# EAGLE design tinyTHP (EAGLE 6.5.0)
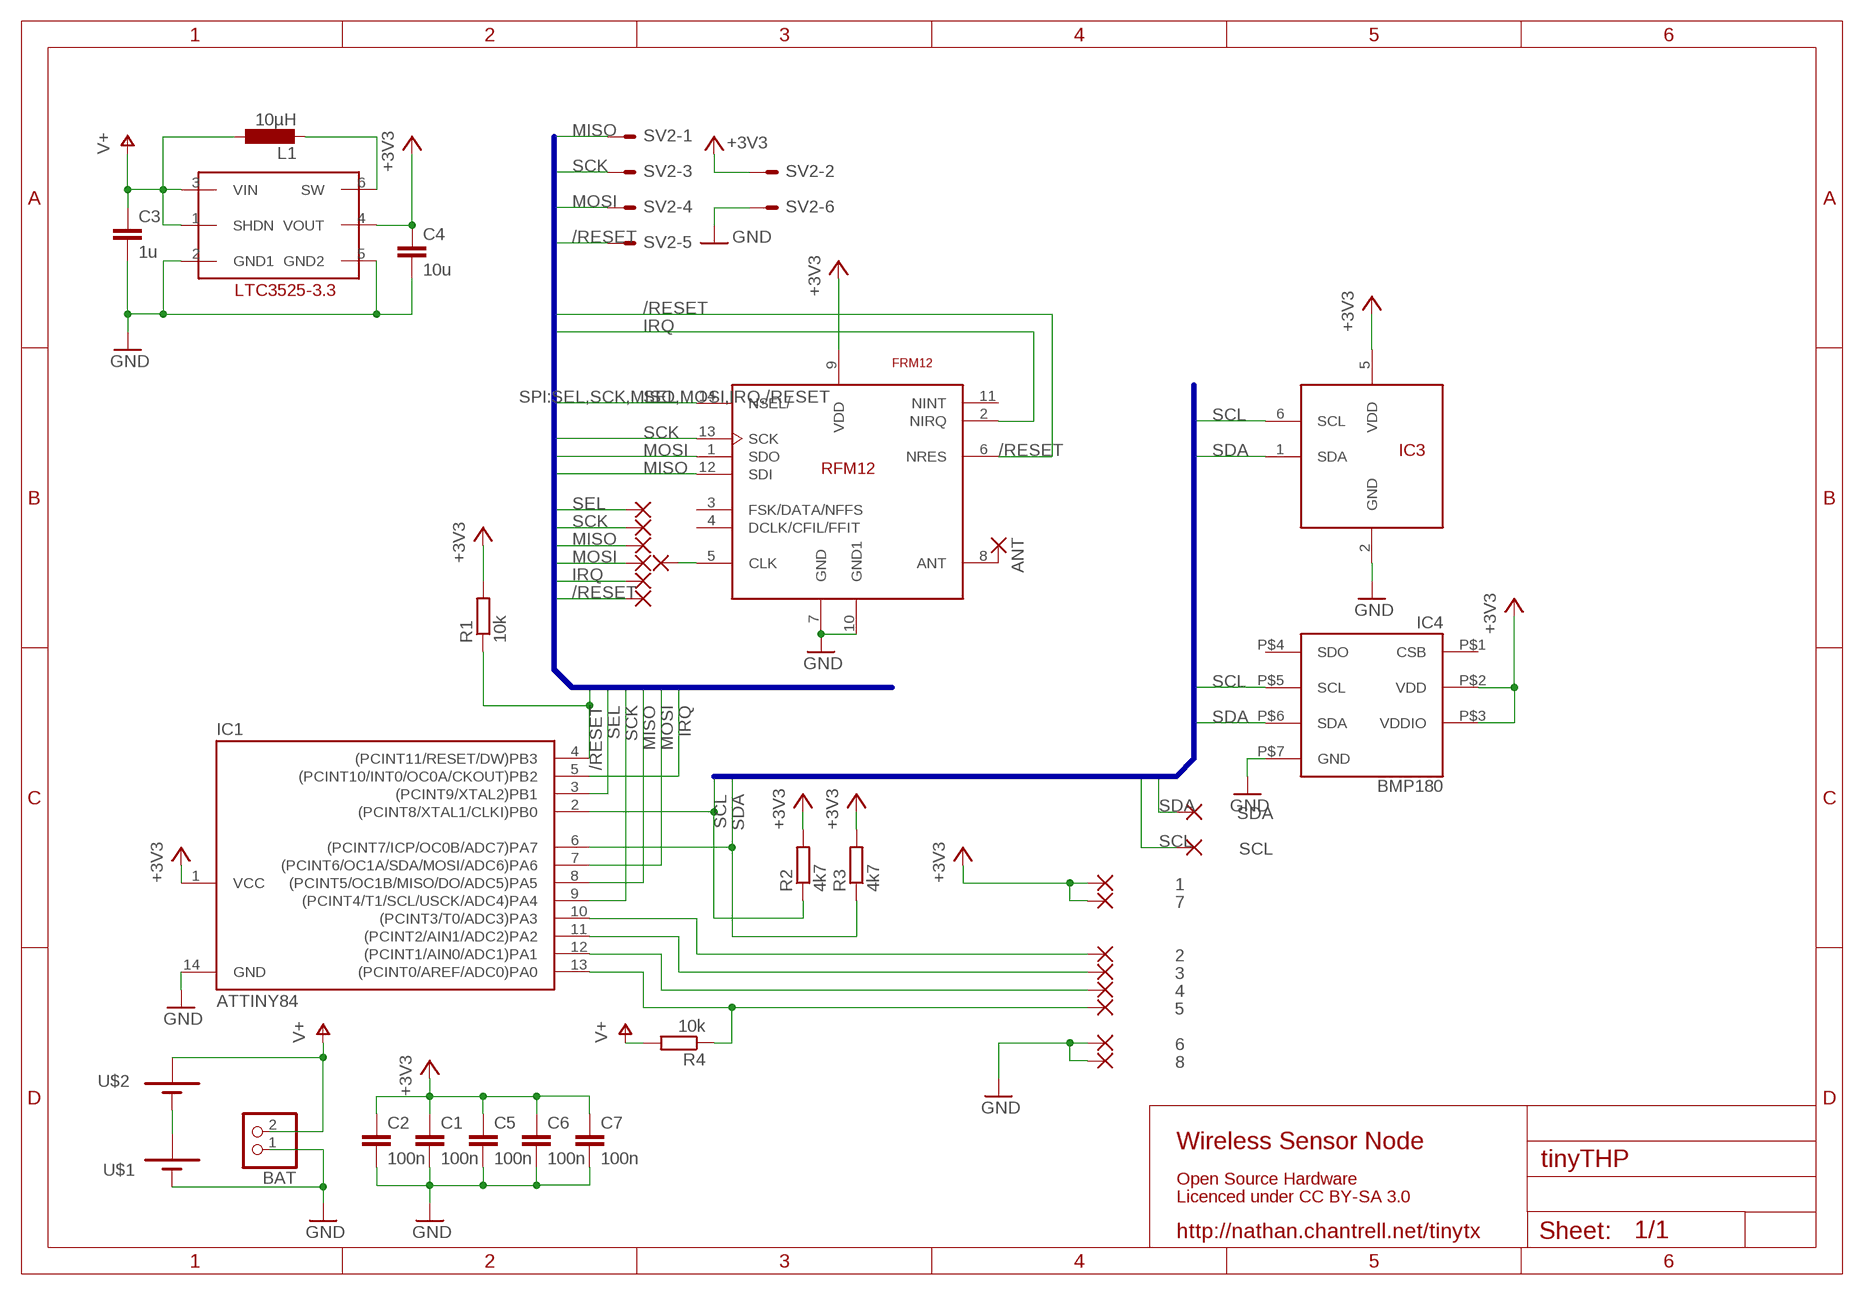
[diagram p0: schematic, sheet 1]

## Parts
1  1,6/0,9  [1,6/0,9]
2  1,6/0,9  [1,6/0,9]
3  1,6/0,9  [1,6/0,9]
4  1,6/0,9  [1,6/0,9]
5  1,6/0,9  [1,6/0,9]
6  1,6/0,9  [1,6/0,9]
7  1,6/0,9  [1,6/0,9]
8  1,6/0,9  [1,6/0,9]
/IRQ  1,6/0,9  [1,6/0,9]
/RESET  1,6/0,9  [1,6/0,9]
ANT  1,6/0,8  [1,6/0,8]
BAT  PINHD-1X2  [1X02]
C1  100n  C-EUC0603  [C0603]
C2  100n  C-EUC0603  [C0603]
C3  1u  C-EUC0603  [C0603]
C4  10u  C-EUC0603  [C0603]
C5  100n  C-EUC0603  [C0603]
C6  100n  C-EUC0603  [C0603]
C7  100n  C-EUC0603  [C0603]
IC1  ATTINY84  TINY24/44/84-SSU  [SOIC14]
IC2  IC2  LTC3525  [SC70-6]
IC3  SI7021  [DFN-6]
IC4  BMP180  [LGA-7]
L1  10µH  L-EUL1616  [L1616]
MISO  1,6/0,9  [1,6/0,9]
MOSI  1,6/0,9  [1,6/0,9]
R1  10k  R-EU_R0603  [R0603]
R2  4k7  R-EU_R0603  [R0603]
R3  4k7  R-EU_R0603  [R0603]
R4  10k  R-EU_R0603  [R0603]
RFMCLK  1,6/0,9  [1,6/0,9]
SCK  1,6/0,9  [1,6/0,9]
SCL  1,6/0,9  [1,6/0,9]
SDA  1,6/0,9  [1,6/0,9]
SEL  1,6/0,9  [1,6/0,9]
SV2  ML6E  [ML6]
U$1  KEYSTONE-92-AA-BATTERY-HOLDER  [KEYSTONE-92-AA-BATTERY]
U$2  KEYSTONE-92-AA-BATTERY-HOLDER  [KEYSTONE-92-AA-BATTERY]
U$3  FRM12  [RFM12]

## Nets
+3V3: 1.1(P) 7.1(P) C1.1 C2.1 C4.1 C5.1 C6.1 C7.1 IC1.1(VCC) IC2.4(VOUT) IC3.5(VDD) IC4.P$2(VDD) IC4.P$3(VDDIO) R1.2 R2.2 R3.2 SV2.2 U$3.9(VDD)
/RESET: /RESET.1(P) IC1.4((PCINT11/RESET/DW)PB3) R1.1 SV2.5 U$3.6(NRES)
ANT: ANT.1(P) U$3.8(ANT)
GND: 6.1(P) 8.1(P) BAT.1 C1.2 C2.2 C3.2 C4.2 C5.2 C6.2 C7.2 IC1.14(GND) IC2.2(GND1) IC2.5(GND2) IC3.2(GND) IC4.P$7(GND) SV2.6 U$1.GND2(-) U$1.GND(-) U$3.7(GND) U$3.10(GND1)
IRQ: /IRQ.1(P) IC1.5((PCINT10/INT0/OC0A/CKOUT)PB2) U$3.2(NIRQ)
MISO: IC1.8((PCINT5/OC1B/MISO/DO/ADC5)PA5) MISO.1(P) SV2.1 U$3.12(SDI)
MOSI: IC1.7((PCINT6/OC1A/SDA/MOSI/ADC6)PA6) MOSI.1(P) SV2.4 U$3.1(SDO)
N$1: 2.1(P) IC1.10((PCINT3/T0/ADC3)PA3)
N$2: 3.1(P) IC1.11((PCINT2/AIN1/ADC2)PA2)
N$3: 4.1(P) IC1.12((PCINT1/AIN0/ADC1)PA1)
N$4: 5.1(P) IC1.13((PCINT0/AREF/ADC0)PA0) R4.1
N$5: U$1.VBATT1(+) U$1.VBATT(+) U$2.GND2(-) U$2.GND(-)
N$6: RFMCLK.1(P) U$3.5(CLK)
N$12: IC2.6(SW) L1.P$2
SCK: IC1.9((PCINT4/T1/SCL/USCK/ADC4)PA4) SCK.1(P) SV2.3 U$3.13(SCK)
SCL: IC1.2((PCINT8/XTAL1/CLKI)PB0) IC3.6(SCL) IC4.P$5(SCL) R2.1 SCL.1(P)
SDA: IC1.6((PCINT7/ICP/OC0B/ADC7)PA7) IC3.1(SDA) IC4.P$6(SDA) R3.1 SDA.1(P)
SEL: IC1.3((PCINT9/XTAL2)PB1) SEL.1(P) U$3.14(NSEL/)
V+: BAT.2 C3.1 IC2.1(SHDN) IC2.3(VIN) L1.P$1 R4.2 U$2.VBATT1(+) U$2.VBATT(+)
Unconnected: IC4.P$1(CSB) IC4.P$4(SDO) U$3.3(FSK/DATA/NFFS) U$3.4(DCLK/CFIL/FFIT) U$3.11(NINT)

## Buses
SPI:SEL,SCK,MISO,MOSI,IRQ,/RESET
I2C:SDA,SCL

## Notes on the sheet
- Wireless Sensor Node
- Open Source Hardware
- Licenced under CC BY-SA 3.0
- http://nathan.chantrell.net/tinytx

## Library data of the parts
1-8 /IRQ /RESET MISO MOSI RFMCLK SCK SCL SDA SEL = wirepad:1,6/0,9: THROUGH-HOLE PAD
ANT = wirepad:1,6/0,8: THROUGH-HOLE PAD
BAT = pinhead:PINHD-1X2: PIN HEADER
C1-C7 = rcl:C-EU: CAPACITOR, European symbol
IC1 = avr-5:TINY24/44/84
IC2 = ltc3525:LTC3525
IC3 = si7021:SI7021
IC4 = projecttree:BMP180
L1 = L1616FSR:L-EU: INDUCTOR, European symbol
R1-R4 = rcl:R-EU_: RESISTOR, European symbol
SV2 = con-harting-ml:ML6?E: HARTING; OC_FARNELL: unknown; OC_NEWARK: unknown
U$1 U$2 = Ava:KEYSTONE-92-AA-BATTERY-HOLDER
U$3 = RFM12:FRM12

## Net classes
0 default: clearance 0.205 mm

## Board
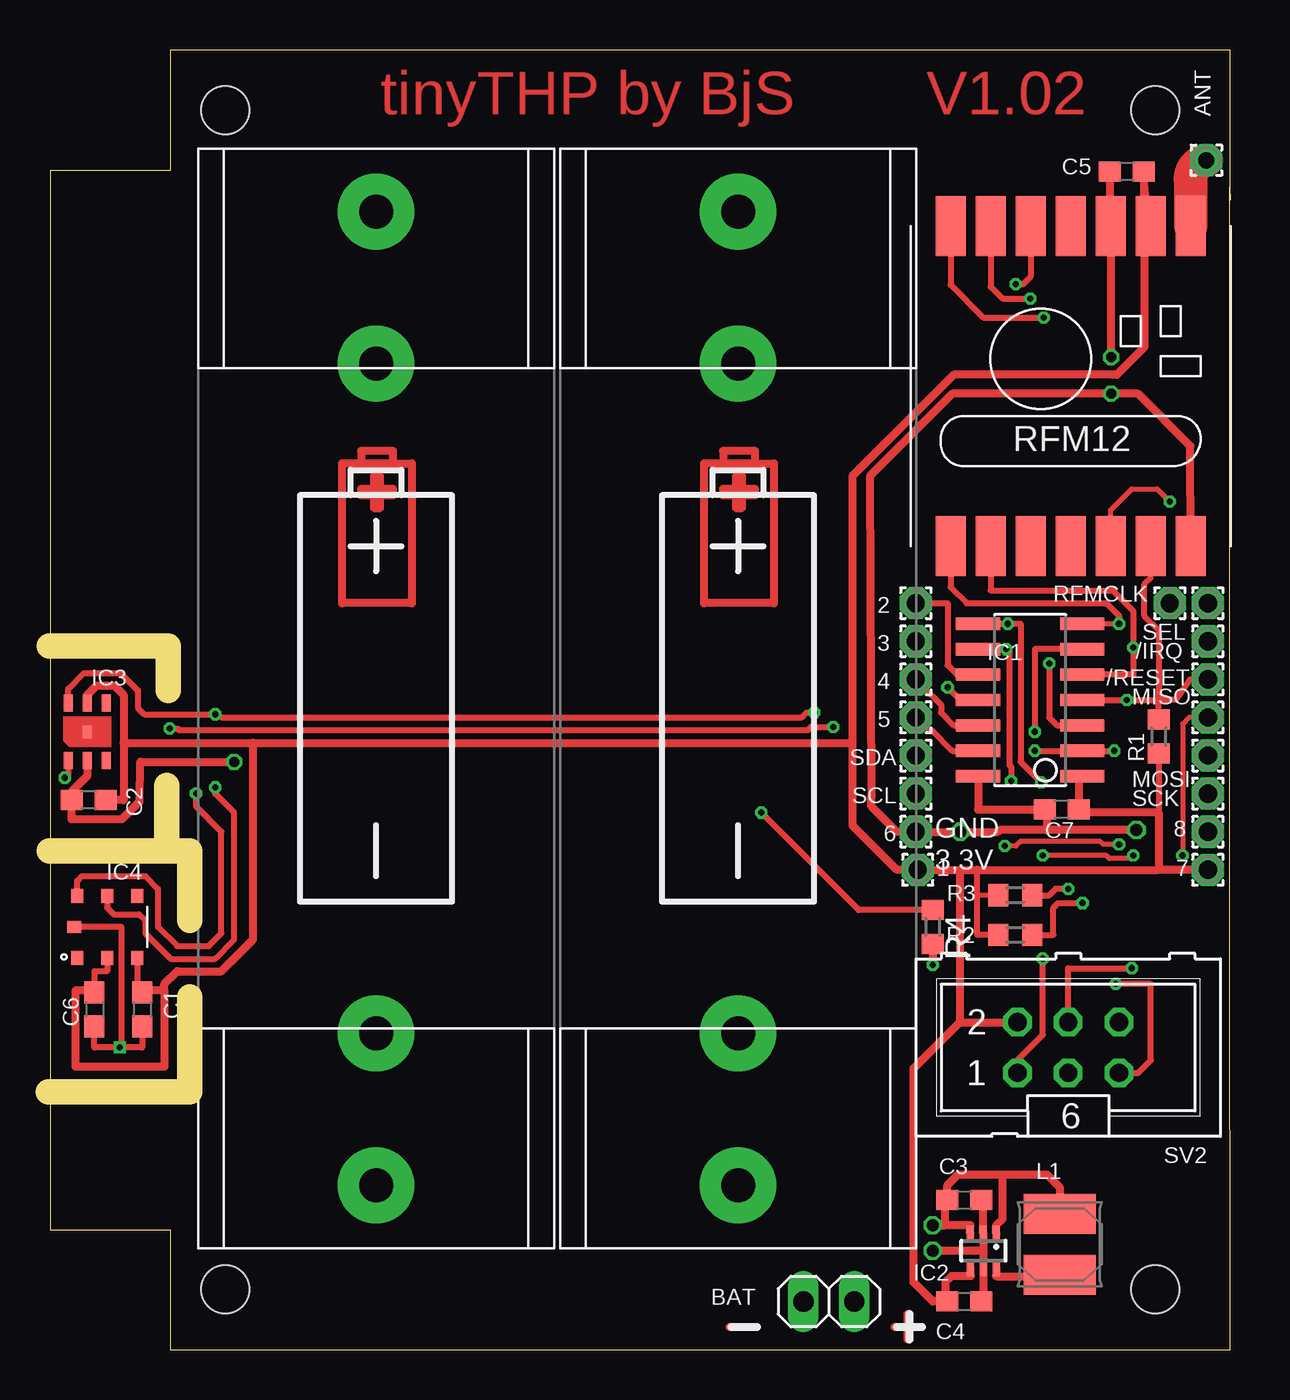
[diagram p1: board, top side]
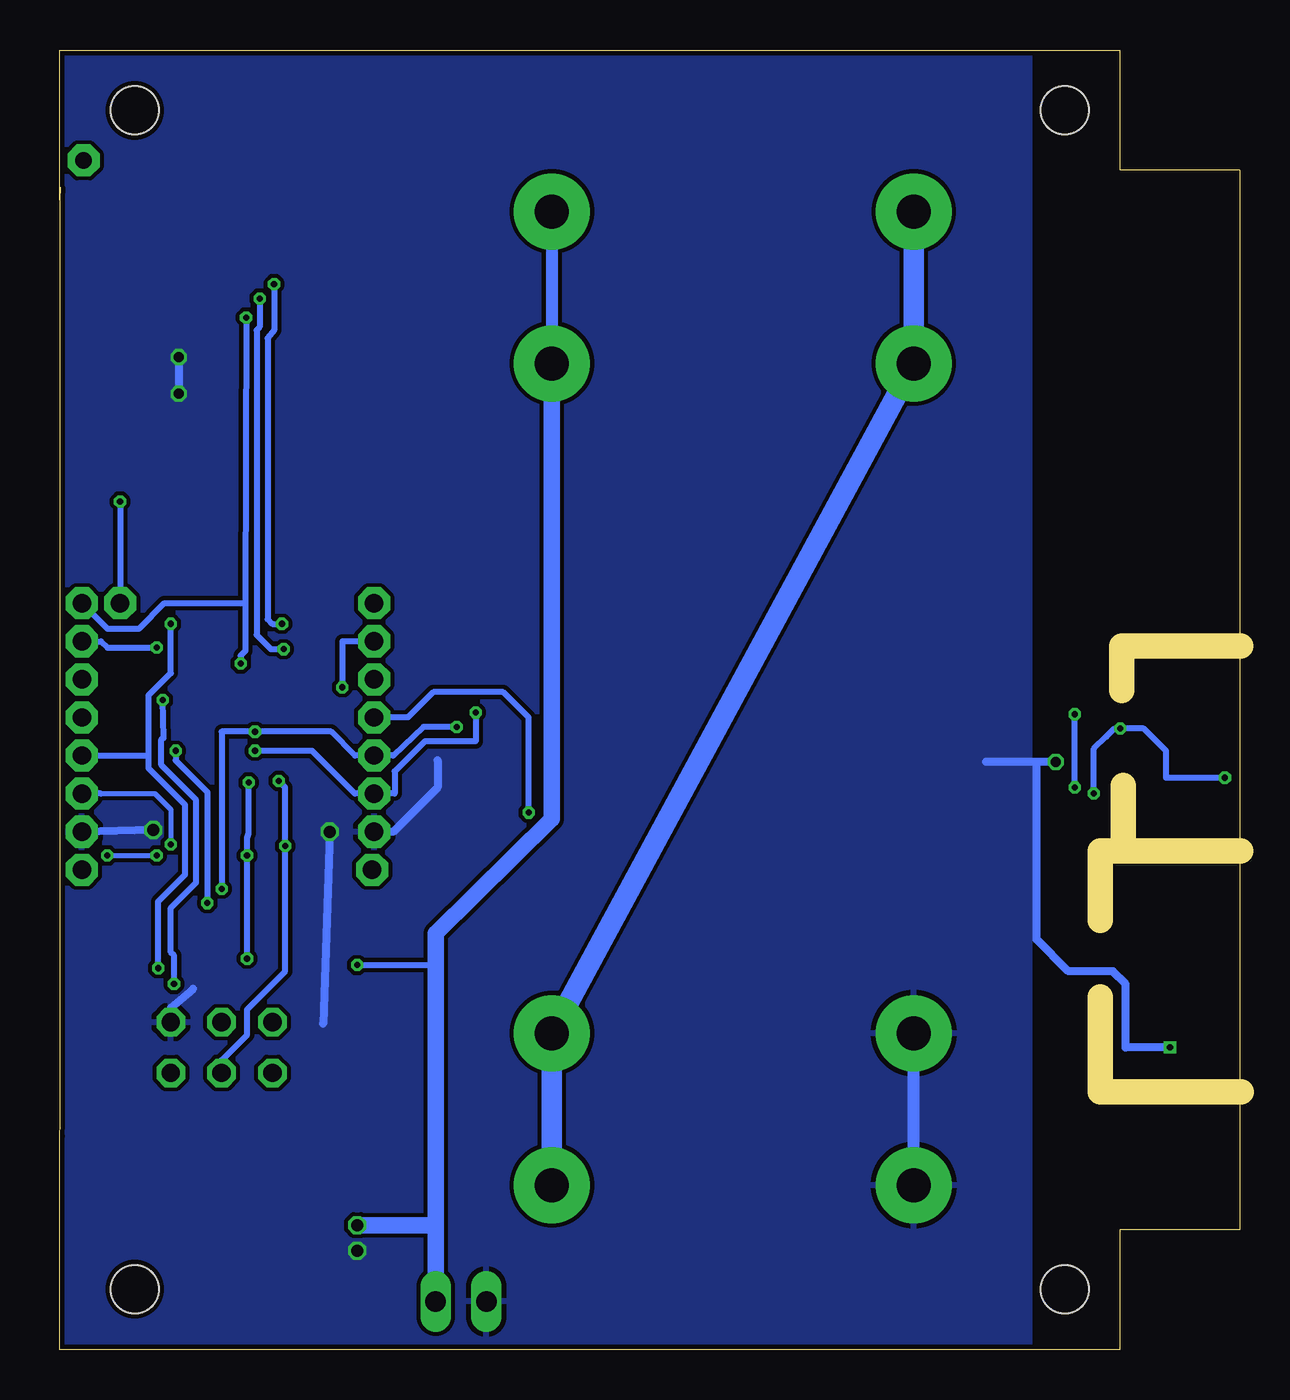
[diagram p2: board, bottom side, seen from below]

Size 59 x 65 mm. Coordinates in mm from the lower left corner, seen from the top.
Outline: 6,0 59,0 59,10.68 58.98,11.31 58.98,58.13 59,57.5 59,65 6,65 6,59 0,59 0,6 6,6 6,0
Copper layers (1*16): Top 0.035mm / dielectric 1.5mm / Bottom 0.035mm
Design rules "Elecrow_2-layer_eagle_rule": minimum track width 6mil, minimum drill 12mil, track to track 6mil, track to pad 6mil, pad to pad 6mil, via to via 6mil, smd to smd 0mil, copper to edge 10mil, drill to drill 10mil, minimum pad ring 10mil, minimum via ring 6mil, stop-mask expansion 2mil, vias tented up to drill 100mil, thermal gap 10mil
Holes 2.4 mm at 8.75,3.02 55.25,3.02 8.75,61.98 55.25,61.98
Milling: 8 lines

### Footprints (pad centres in the part's own frame; a part is rotated, then mirrored left to right if it is on the bottom)
1,6/0,9 = drill 0.914 pad 1.6 octagon: 1 0,0
1,6/0,8 = drill 0.813 pad 1.6 octagon: 1 0,0
1X02 = drill 1.016 long: 1 -1.27,0; 2 1.27,0
C0603 = smd 1.1 x 1: 1 -0.85,0; 2 0.85,0
SOIC14 = smd 0.61 x 2.21: 1 -3.81,-2.603; 2 -2.54,-2.603; 3 -1.27,-2.603; 4 0,-2.603; 5 1.27,-2.603; 6 2.54,-2.603; 7 3.81,-2.603; 8 3.81,2.603; 9 2.54,2.603; 10 1.27,2.603; 11 0,2.603; 12 -1.27,2.603; 13 -2.54,2.603; 14 -3.81,2.603
SC70-6 = smd 0.35 x 0.8: 1 -0.65,-0.85; 2 0,-0.85; 3 0.65,-0.85; 4 0.65,0.85; 5 0,0.85; 6 -0.65,0.85
DFN-6 = smd 0.45 x 0.83: 1 -0.95,-1.44; 2 0,-1.44; 3 0.95,-1.44; 4 0.95,1.435; 5 0,1.435; 6 -0.95,1.435 | smd 0.45 x 0.63: PAD 0,0
LGA-7 = smd 0.6 x 0.7: P$1 1.5,1.55; P$2 0,1.55; P$3 -1.5,1.55; P$4 -1.5,-1.55; P$5 0,-1.55; P$6 1.5,-1.55 | smd 0.7 x 0.6: P$7 1.65,0
L1616 = smd 2 x 3.6: P$1 -1.525,0; P$2 1.525,0
R0603 = smd 1 x 1.1: 1 -0.85,0; 2 0.85,0
ML6 = drill 0.914 octagon: 1 -2.54,-1.27; 2 -2.54,1.27; 3 0,-1.27; 4 0,1.27; 5 2.54,-1.27; 6 2.54,1.27
KEYSTONE-92-AA-BATTERY = drill 1.7 pad 3.81: GND -24.35,0; GND2 -16.75,0; VBATT 16.75,0; VBATT1 24.35,0
RFM12 = smd 1.5 x 3: 1 -5,-10; 2 -3,-10; 3 -1,-10; 4 1,-10; 5 3,-10; 6 5,-10; 7 7,-10; 8 7,6; 9 5,6; 10 3,6; 11 1,6; 12 -1,6; 13 -3,6; 14 -5,6

### Placement (x,y rotation side)
1  43.39,24 180 top
2  43.29,37.33 0 top
3  43.29,35.42 0 top
4  43.29,33.52 0 top
5  43.29,31.61 0 top
6  43.29,25.9 0 top
7  57.9,24 0 top
8  57.9,25.9 0 top
/IRQ  57.9,35.42 0 top
/RESET  57.9,33.52 0 top
ANT  57.82,59.48 0 top
BAT  38.94,2.41 0 top
C1  4.6,17.01 270 top
C2  1.94,27.49 180 top
C3  45.72,7.49 0 top
C4  45.72,2.41 0 top
C5  53.85,58.92 180 top
C6  2.22,17.01 270 top
C7  50.59,27.01 180 top
IC1  49.01,32.49 90 top
IC2  46.67,4.95 180 top
IC3  1.86,30.9 0 top
IC4  2.86,21.14 180 top
L1  50.48,5.26 270 top
MISO  57.9,31.61 0 top
MOSI  57.9,29.71 0 top
R1  55.43,30.66 270 top
R2  48.26,20.74 180 top
R3  48.26,22.73 180 top
R4  44.13,21.14 270 top
RFMCLK  55.99,37.33 0 top
SCK  57.9,27.8 0 top
SCL  43.29,27.8 0 top
SDA  43.29,29.71 0 top
SEL  57.9,37.33 0 top
SV2  50.91,15.11 0 top
U$1  16.3,32.57 90 top
U$2  34.4,32.57 90 top
U$3  50.04,50.19 0 top

### Tracks (layer width: path | path; a pad name or v marks a point on that pad's centre or on a via)
+3V3
  Top 0.254: R3.2 46.35,22.73
  Top 0.305: R1.2 55.43,26.85 | 46.35,24 46.35,22.73 46.35,20.74 R2.2 | 1.91,17.96 C6.1 2.22,17.96 2.22,18.91 2.86,18.91 IC4.P$2 | C1.1 4.36,17.86 IC4.P$3 4.36,17.96 4.45,17.96 C1.1 | 4.55,17.96 C1.1
  Top 0.406: IC3.5 1.86,32.73 2.33,33.2 3.21,33.2 3.68,32.73 3.68,30.34 | 3.68,30.34 3.68,27.49 C2.1 | 55.43,24 55.43,26.85 51.55,26.85 C7.1 51.44,28.68 IC1.1 | 40.12,30.34 40.12,43.68 45.2,48.76 53.13,48.76 53.34,48.76 54.72,50.14 54.72,58.09 U$3.9 54.7,56.53 C5.1 | 40.12,30.34 40.12,26.22 42.34,24 1.1 45.51,24 | 7.1 55.43,24 | 3.68,30.34 10.16,30.34 | 10.16,30.34 40.12,30.34 | 45.51,24 46.35,24 55.43,24 | 45.51,24 45.51,16.38 SV2.2 45.48,16.38 43.18,14.07 43.18,3.36 44.13,2.41 44.77,2.41 44.77,2.94 | 5.71,17.96 4.55,17.96 | 5.71,17.96 5.71,14.15 1.27,14.15 1.27,17.96 2.22,17.96 | 5.71,17.96 5.71,18.28 6.35,18.91 8.57,18.91 10.16,20.5 10.16,30.34 | 44.77,2.94 44.77,3.36 45.09,3.67 46.04,3.67 46.02,3.69 IC2.4 | 44.77,2.94 C4.1
/RESET  (via drill 0.3)
  Top 0.305: IC1.4 v53.85,32.49 55.43,32.49 | U$3.6 55.04,38.6 54.72,38.28 54.72,36.7 55.43,35.98 55.43,32.49 | 55.43,32.49 56.31,32.49 57.02,33.52 /RESET.1 | SV2.5 54.4,13.84 55.04,14.47 55.04,18.28 v53.29,18.28 | R1.1 55.43,32.49
  Bottom 0.305: v53.29,18.28 53.29,19.71 53.45,19.87 53.45,22.09 52.18,23.36 52.18,27.49 53.93,29.23 53.93,30.47 arc90 53.82,30.58 v53.85,32.49
ANT
  Top 1.676: U$3.8 57.04,58.38 arc-90 ANT.1
GND  (via drill 0.3, 0.5, 0.6)
  Top 0.305: IC4.P$7 3.57,21.14 3.57,15.18 | C1.2 4.6,15.11 3.57,15.11 | 3.57,15.11 v3.49,15.11 | v3.49,15.11 2.22,15.11 C6.2 | 3.57,15.18 3.57,15.11 | 3.57,15.18 v3.49,15.11
  Top 0.406: v9.21,29.39 4.52,29.39 4.48,27.41 3.6,26.54 1.06,26.54 C2.2 1.09,27.91 1.86,28.68 IC3.2 | U$3.7 57.02,45.19 54.4,47.81 v53.05,47.81 45.12,47.81 40.99,43.68 41.07,27.65 41.07,27.17 42.34,25.9 6.1 v45.51,25.9 47.39,25.9 47.47,25.98 49.85,25.98 | IC1.14 46.4,27.01 C7.2 49.85,26.91 49.85,25.98 | C5.2 53,56.23 U$3.10 53.04,49.65 v53.05,49.63 | v54.32,25.98 49.85,25.98 | 46.67,4.95 IC2.2 46.67,7.38 C3.2 | 46.67,4.95 IC2.5 46.67,2.51 C4.2 | 46.67,4.95 v44.13,4.95
  Bottom 0.305: 15.67,15.11 16.3,14.47
  Bottom 0.406: v45.51,25.9 45.83,16.3 | SV2.6 53.45,17.09 52.34,18.04 | v54.32,25.98 8.1 | 40.12,29.47 40.12,28.12 42.34,25.9 6.1 | v53.05,49.63 v53.05,47.81 | v9.21,29.39 10.16,29.39 | 10.16,29.39 12.7,29.39 | v3.49,15.11 5.71,15.11 5.71,18.28 6.35,18.91 8.57,18.91 10.16,20.5 10.16,29.39
  Bottom 0.61: U$1.GND 16.3,14.47 U$1.GND2
  pour Bottom: 10.5,64.95 58.85,64.95 58.85,-0.14 10.5,-0.14
IRQ  (via drill 0.3)
  Top 0.305: U$3.2 47.04,37.97 53.13,37.97 54.16,36.93 v54.16,35.11 54.16,33.76 IC1.5
  Bottom 0.305: /IRQ.1 56.94,35.42 56.62,35.11 v54.16,35.11
MISO  (via drill 0.3)
  Top 0.254: MISO.1 56.94,31.61 56.62,31.3 v56.62,24.71 | v54.16,24.71 54.01,24.55 52.97,24.55 52.81,24.71 v49.64,24.71
  Top 0.305: U$3.12 49.04,53.66 48.66,53.28 v48.29,53.28 | IC1.8 v47.89,36.3 48.53,36.3 48.53,29.39 v49.56,28.36 | SV2.1 48.37,14.47 49.64,15.74 v49.64,19.55
  Bottom 0.254: v56.62,24.71 v54.16,24.71
  Bottom 0.305: v48.29,53.28 48.29,50.98 48.61,50.59 48.61,36.54 48.37,36.3 v47.89,36.3 | v49.64,19.55 v49.64,24.71 49.64,25.58 49.56,25.82 v49.56,28.36
MOSI  (via drill 0.3)
  Top 0.254: v53.45,36.3 IC1.7
  Top 0.305: U$3.1 45.04,38.12 45.83,37.33 52.81,37.33 53.45,36.7 v53.45,36.3 | SV2.4 50.91,19.07 v54.09,19.07
  Bottom 0.305: v54.09,19.07 54.09,22.41 52.74,23.76 52.74,27.25 54.56,29.07 54.56,29.71 | 54.56,29.71 54.56,32.73 53.45,33.84 v53.45,36.3 | MOSI.1 54.56,29.71
N$1
  Top 0.305: 2.1 44.88,37.33 44.88,34.23 45.35,33.76 IC1.10
N$2  (via drill 0.3)
  Top 0.305: v44.88,33.12 45.51,32.49 IC1.11
  Bottom 0.305: 3.1 44.88,35.42 v44.88,33.12
N$3
  Top 0.254: 45.27,31.22 IC1.12
  Top 0.305: 45.27,31.22 45.2,31.22 44.56,31.85 44.56,32.25 44.24,32.57 43.29,33.44 4.1
N$4  (via drill 0.3)
  Top 0.305: 5.1 43.92,30.98 44.08,30.98 45.12,29.95 IC1.13 | R4.1 40.42,21.99 v35.56,26.85
  Bottom 0.305: v35.56,26.85 35.56,31.61 36.83,32.88 40.32,32.88 41.59,31.61 5.1
N$5
  Bottom 1.016: U$2.GND U$2.GND2 U$1.VBATT U$1.VBATT1
N$6  (via drill 0.3)
  Top 0.254: U$3.5 53.04,42 54.09,43.05 55.35,43.05 v55.99,42.41
  Bottom 0.305: v55.99,42.41 RFMCLK.1
N$7
  Top 0.406: 17.14,44.31 17.14,44.95 15.56,44.95 15.56,44.31 | 17.14,44.31 15.56,44.31 | 15.56,44.31 14.61,44.31 14.61,37.33 18.1,37.33 18.1,44.31 17.14,44.31
N$8
  Top 0.406: 16.19,43.68 16.19,43.05 15.56,43.05 15.56,42.73 16.19,42.73 16.19,42.09 16.51,42.09 16.51,42.73 17.14,42.73 17.14,43.05 16.51,43.05 16.51,43.68 16.19,43.68
N$9
  Top 0.406: 35.24,44.31 35.24,44.95 33.66,44.95 33.66,44.31 | 35.24,44.31 33.66,44.31 | 33.66,44.31 32.7,44.31 32.7,37.33 36.2,37.33 36.2,44.31 35.24,44.31
N$10
  Top 0.406: 34.29,43.68 34.29,43.05 33.66,43.05 33.66,42.73 34.29,42.73 34.29,42.09 34.61,42.09 34.61,42.73 35.24,42.73 35.24,43.05 34.61,43.05 34.61,43.68 34.29,43.68
N$11
  Top 0.406: 33.97,1.14 35.24,1.14
N$12
  Top 0.406: IC2.6 47.32,3.69 47.31,3.67 50.42,3.67 L1.P$2
N$13
  Top 0.406: 42.23,1.14 43.5,1.14
N$14
  Top 0.406: 42.86,1.77 42.86,0.5
SCK  (via drill 0.3)
  Top 0.254: v53.45,25.27 52.66,25.27 52.5,25.42 48.53,25.42 48.29,25.19 v47.73,25.19
  Top 0.305: U$3.13 47.04,53.16 47.62,52.57 v49.01,52.57 | IC1.9 v47.81,35.03 47.97,35.03 47.97,29.23 48.05,29.15 v48.05,28.44
  Bottom 0.254: 56.94,27.8 54.24,27.8 53.45,27.01 v53.45,25.27
  Bottom 0.305: v49.01,52.57 49.01,51.14 49.16,50.98 49.16,35.74 48.45,35.03 v47.81,35.03 | SV2.3 50.91,14.47 49.64,15.74 49.64,17.01 47.73,18.91 v47.73,25.19 47.73,28.12 v48.05,28.44 | 56.94,27.8 SCK.1
SCL  (via drill 0.3)
  Top 0.305: IC3.6 0.9,33.04 1.7,33.84 3.52,33.84 4.4,32.96 4.4,32.09 4.71,31.77 v8.26,31.77 | 7.97,31.77 v8.26,31.77 | v8.26,31.77 8.41,31.77 8.57,31.61 37.58,31.61 37.81,31.85 v38.21,31.85 | v53.21,29.95 IC1.2 v49.24,29.95 | R2.1 50.16,20.74 50.16,22.09 50.4,22.33 v51.62,22.33 | IC4.P$5 2.86,22.09 3.17,21.77 4.45,21.77 4.76,21.45 4.76,20.82 6.03,19.55 8.26,19.55 9.21,20.5 9.21,26.85 8.26,27.8 v8.26,28.12
  Bottom 0.305: v53.21,29.95 53.21,29.47 51.62,27.88 v51.62,22.33 | v38.21,31.85 38.21,30.42 40.75,30.42 42.26,28.92 42.26,27.8 SCL.1 44.24,27.8 46.39,29.95 v49.24,29.95 | v8.26,28.12 v8.26,31.77
SDA  (via drill 0.3)
  Top 0.305: IC3.1 0.9,28.76 v0.74,28.6 | v5.98,31.06 6.38,31.06 6.46,30.98 37.89,30.98 38.05,31.14 v39.16,31.14 | IC1.6 49.24,35.03 v49.24,30.9 | R3.1 49.96,22.73 50.27,23.04 v50.91,23.04 | IC4.P$6 1.36,23.45 1.59,23.68 4.76,23.68 5.4,23.04 5.4,21.14 6.35,20.18 7.94,20.18 8.57,20.82 8.57,25.9 7.3,27.17 v7.3,27.8
  Bottom 0.305: v0.74,28.6 3.68,28.6 3.68,29.95 4.79,31.06 v5.98,31.06 6.27,31.06 6.67,30.66 7.3,30.06 v7.3,27.8 | v50.91,23.04 50.91,30.9 v49.24,30.9 45.43,30.9 44.24,29.71 SDA.1 42.34,29.71 40.83,31.14 v39.16,31.14
SEL  (via drill 0.3)
  Top 0.305: U$3.14 45.04,53.25 46.67,51.62 v49.69,51.62 | v49.96,34.31 49.96,31.61 50.35,31.22 IC1.3
  Bottom 0.305: v49.69,51.62 49.72,37.33 | 49.72,37.33 49.72,34.95 49.96,34.71 v49.96,34.31 | SEL.1 56.62,36.06 55.04,36.06 53.77,37.33 49.72,37.33
V+  (via drill 0.3, 0.6)
  Top 0.406: IC2.3 46.02,6.21 44.77,6.21 | 44.77,6.21 44.77,7.38 C3.1 44.87,8.22 45.4,8.76 47.62,8.76 | 47.62,8.76 49.85,8.76 50.48,8.12 L1.P$1 | IC2.1 47.32,6.23 47.62,6.53 47.62,8.76 | v44.13,6.21 44.77,6.21 | R4.2 v44.13,19.23
  Bottom 0.305: v44.13,19.23 40.21,19.23
  Bottom 0.61: U$2.VBATT1 U$2.VBATT
  Bottom 0.813: U$2.VBATT 34.4,26.54 40.21,20.82 40.21,19.23 40.21,6.21 | BAT.2 40.21,6.21 | v44.13,6.21 40.21,6.21

### Text on the board
Top: tinyTHP by BjS | V1.02
tPlace: GND | 3,3V
tStop: tinyTHP by BjS
bStop: tinyTHP by BjS | V1.02